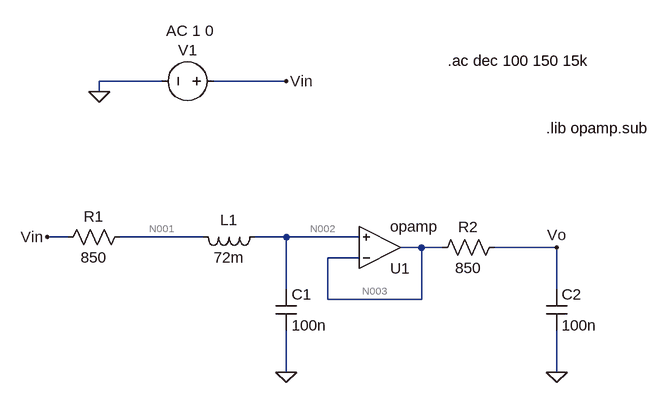
[diagram p0: schematic Circuito_Valores_Butter.asc]
Circuito_Valores_Butter.asc, the LTspice schematic file:
Version 4
SHEET 1 880 680
WIRE -160 -128 -256 -128
WIRE 32 -128 -80 -128
WIRE -256 -112 -256 -128
WIRE -304 112 -336 112
WIRE -96 112 -224 112
WIRE 32 112 -16 112
WIRE 144 112 32 112
WIRE 240 128 208 128
WIRE 272 128 240 128
WIRE 448 128 352 128
WIRE 144 144 96 144
WIRE 32 192 32 112
WIRE 448 192 448 128
WIRE 96 208 96 144
WIRE 240 208 240 128
WIRE 240 208 96 208
WIRE 32 320 32 256
WIRE 448 320 448 256
FLAG 32 320 0
FLAG 448 320 0
FLAG -336 112 Vin
FLAG 448 128 Vo
FLAG -256 -112 0
FLAG 32 -128 Vin
SYMBOL OpAmps\\opamp 176 192 M180
SYMATTR InstName U1
SYMBOL res -208 96 R90
WINDOW 0 0 56 VBottom 2
WINDOW 3 32 56 VTop 2
SYMATTR InstName R1
SYMATTR Value 850
SYMBOL res 368 112 R90
WINDOW 0 0 56 VBottom 2
WINDOW 3 32 56 VTop 2
SYMATTR InstName R2
SYMATTR Value 850
SYMBOL ind 0 96 R90
WINDOW 0 5 56 VBottom 2
WINDOW 3 32 56 VTop 2
SYMATTR InstName L1
SYMATTR Value 72m
SYMBOL cap 16 192 R0
SYMATTR InstName C1
SYMATTR Value 100n
SYMBOL cap 432 192 R0
SYMATTR InstName C2
SYMATTR Value 100n
SYMBOL voltage -64 -128 R90
WINDOW 0 -32 56 VBottom 2
WINDOW 3 32 56 VTop 2
WINDOW 123 -62 52 VBottom 2
WINDOW 39 0 0 Left 0
SYMATTR InstName V1
SYMATTR Value ""
SYMATTR Value2 AC 1 0
TEXT 432 -56 Left 2 !.lib opamp.sub
TEXT 280 -160 Left 2 !.ac dec 100 150 15k

The netlist it stands for:
* Circuito_Valores_Butter.asc
XU1 N003 N002 N003 opamp Aol=100K GBW=10Meg  ; pins invin noninvin out
R1 N001 Vin 850
R2 Vo N003 850
L1 N002 N001 72m
C1 N002 0 100n
C2 Vo 0 100n
V1 Vin 0 AC 1 0
.lib opamp.sub
.ac dec 100 150 15k
.backanno
.end

* Results of the author's LTspice run, read from the files saved beside the schematic
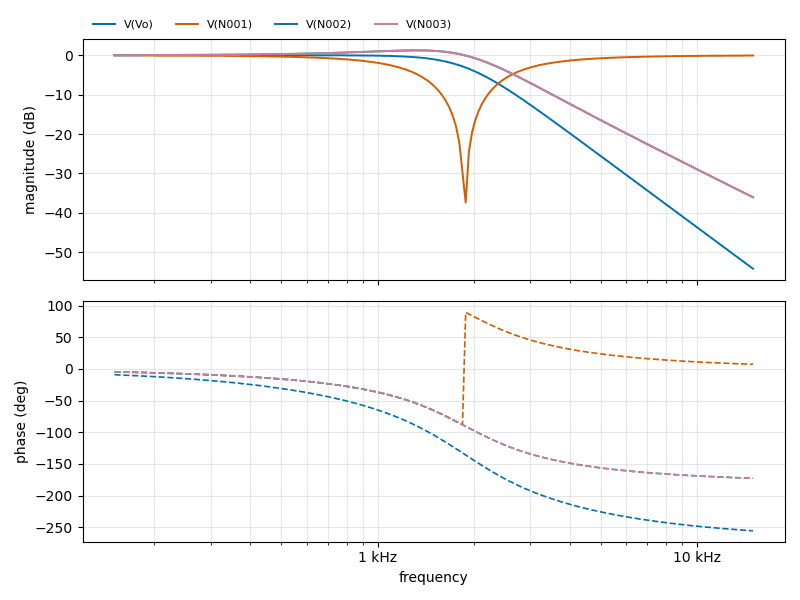
[diagram p1: AC Analysis of Circuito_Valores_Butter.asc, plotted from the saved traces]
* AC Analysis, 1 run:
*   V(Vo): -0.00 dB at 150 Hz, -54.19 dB at 15 kHz, peak -0.00 dB at 150 Hz, 3 dB below the peak at 1.872 kHz
*   V(N001): -0.03 dB at 150 Hz, -0.07 dB at 15 kHz, peak -0.03 dB at 150 Hz, 3 dB below the peak at 1.162 kHz
*   V(N002): 0.03 dB at 150 Hz, -36.05 dB at 15 kHz, peak 1.24 dB at 1.337 kHz, 3 dB below the peak at 2.191 kHz
*   V(N003): 0.03 dB at 150 Hz, -36.05 dB at 15 kHz, peak 1.24 dB at 1.337 kHz, 3 dB below the peak at 2.191 kHz